# Altium schematic sheet obc-v2_TMP-eMMC.SchDoc
size 420 x 297 mm; SheetNumber: 6; SheetTotal: 23
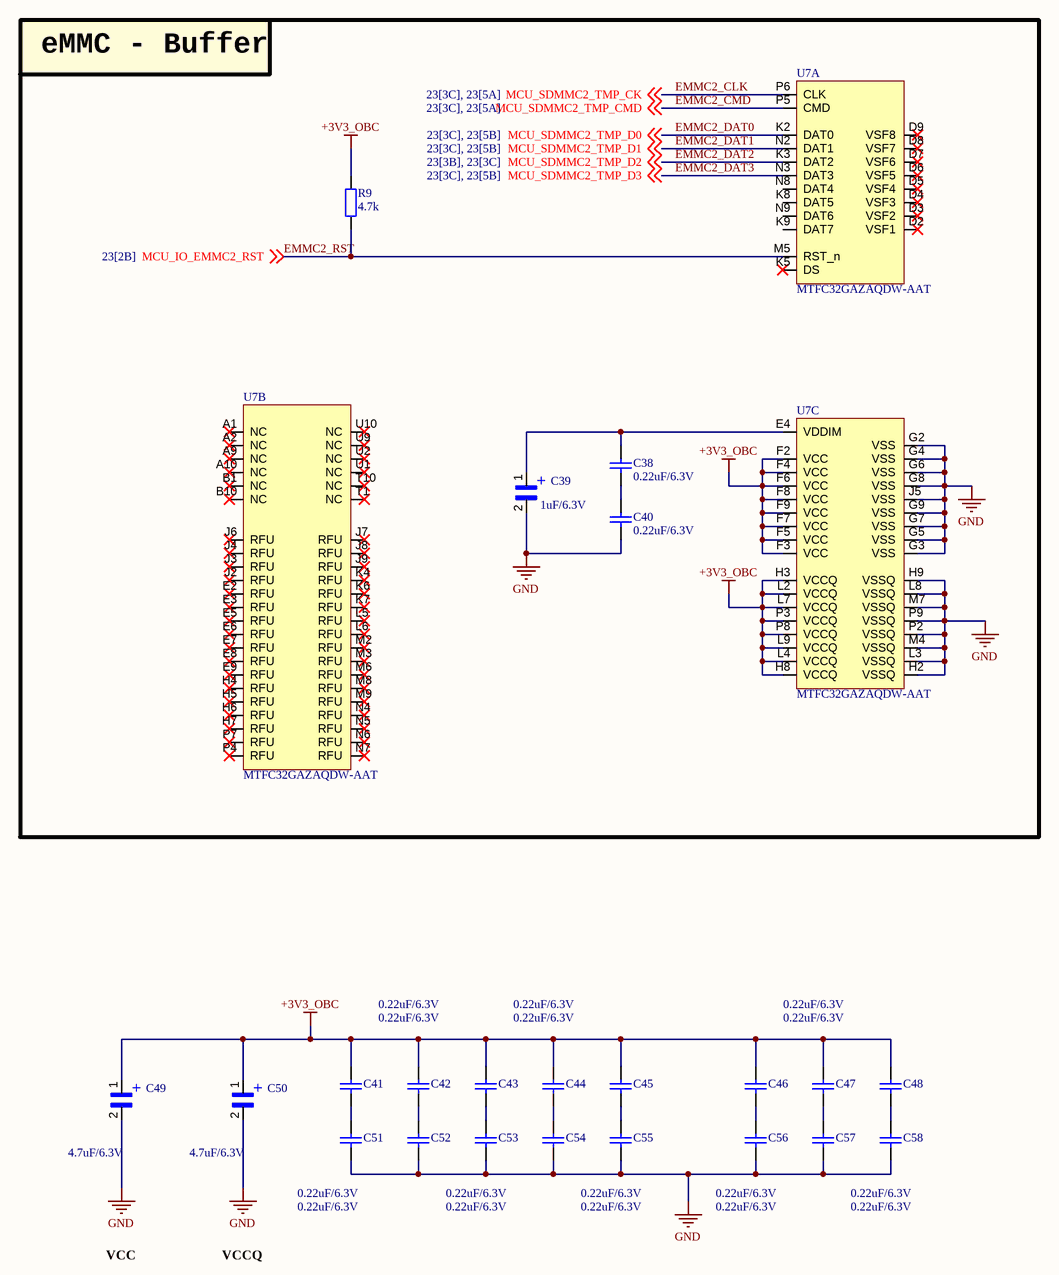
[diagram p0: obc-v2_TMP-eMMC.SchDoc]

## Parts
C38  0.22uF/6.3V  [CAP_C_1005X60]
C39  1uF/6.3V  [CAP_MP_1608X90]
C40  0.22uF/6.3V  [CAP_C_1005X60]
C41  0.22uF/6.3V  [CAP_C_1005X60]
C42  0.22uF/6.3V  [CAP_C_1005X60]
C43  0.22uF/6.3V  [CAP_C_1005X60]
C44  0.22uF/6.3V  [CAP_C_1005X60]
C45  0.22uF/6.3V  [CAP_C_1005X60]
C46  0.22uF/6.3V  [CAP_C_1005X60]
C47  0.22uF/6.3V  [CAP_C_1005X60]
C48  0.22uF/6.3V  [CAP_C_1005X60]
C49  4.7uF/6.3V  [CAP_MP_1608X90]
C50  4.7uF/6.3V  [CAP_MP_1608X90]
C51  0.22uF/6.3V  [CAP_C_1005X60]
C52  0.22uF/6.3V  [CAP_C_1005X60]
C53  0.22uF/6.3V  [CAP_C_1005X60]
C54  0.22uF/6.3V  [CAP_C_1005X60]
C55  0.22uF/6.3V  [CAP_C_1005X60]
C56  0.22uF/6.3V  [CAP_C_1005X60]
C57  0.22uF/6.3V  [CAP_C_1005X60]
C58  0.22uF/6.3V  [CAP_C_1005X60]
R9  4.7k  [RES_C_1608X60]
U7  MTFC32GAZAQDW-AAT  [BGA_100_C_100P_10X17_1400X1800X150]  (parts A,B,C of 3)

## Blocks framed on the sheet
eMMC - Buffer: C38-C40 R9 U7

## Nets
+3V3_OBC: C41.1 C42.1 C43.1 C44.1 C45.1 C46.1 C47.1 C48.1 C49.1 C50.1 R9.1 U7.F2(VCC) U7.F3(VCC) U7.F4(VCC) U7.F5(VCC) U7.F6(VCC) U7.F7(VCC) U7.F8(VCC) U7.F9(VCC) U7.H3(VCCQ) U7.H8(VCCQ) U7.L2(VCCQ) U7.L4(VCCQ) U7.L7(VCCQ) U7.L9(VCCQ) U7.P3(VCCQ) U7.P8(VCCQ)
GND: C39.2 C40.2 C49.2 C50.2 C51.2 C52.2 C53.2 C54.2 C55.2 C56.2 C57.2 C58.2 U7.G2(VSS) U7.G3(VSS) U7.G4(VSS) U7.G5(VSS) U7.G6(VSS) U7.G7(VSS) U7.G8(VSS) U7.G9(VSS) U7.H2(VSSQ) U7.H9(VSSQ) U7.J5(VSS) U7.L3(VSSQ) U7.L8(VSSQ) U7.M4(VSSQ) U7.M7(VSSQ) U7.P2(VSSQ) U7.P9(VSSQ)
EMMC2_CLK: U7.P6(CLK) ; off-sheet MCU_SDMMC2_TMP_CK  [also labelled MCU_SDMMC2_TMP_CK]
EMMC2_CMD: U7.P5(CMD) ; off-sheet MCU_SDMMC2_TMP_CMD  [also labelled MCU_SDMMC2_TMP_CMD]
EMMC2_DAT0: U7.K2(DAT0) ; off-sheet MCU_SDMMC2_TMP_D0  [also labelled MCU_SDMMC2_TMP_D0]
EMMC2_DAT1: U7.N2(DAT1) ; off-sheet MCU_SDMMC2_TMP_D1  [also labelled MCU_SDMMC2_TMP_D1]
EMMC2_DAT2: U7.K3(DAT2) ; off-sheet MCU_SDMMC2_TMP_D2  [also labelled MCU_SDMMC2_TMP_D2]
EMMC2_DAT3: U7.N3(DAT3) ; off-sheet MCU_SDMMC2_TMP_D3  [also labelled MCU_SDMMC2_TMP_D3]
EMMC2_RST: R9.2 U7.M5(RST_n) ; off-sheet MCU_IO_EMMC2_RST  [also labelled MCU_IO_EMMC2_RST]
NetC38_1: C38.1 C39.1 U7.E4(VDDIM)
NetC38_2: C38.2 C40.1
NetC41_2: C41.2 C51.1
NetC42_2: C42.2 C52.1
NetC43_2: C43.2 C53.1
NetC44_2: C44.2 C54.1
NetC45_2: C45.2 C55.1
NetC46_2: C46.2 C56.1
NetC47_2: C47.2 C57.1
NetC48_2: C48.2 C58.1

Not connected (* = marked no-connect by the designer): U7 A1(NC)* A2(NC)* A9(NC)* A10(NC)* B1(NC)* B10(NC)* D2(VSF1)* D3(VSF2)* D4(VSF3)* D5(VSF4)* D6(VSF5)* D7(VSF6)* D8(VSF7)* D9(VSF8)* E2(RFU)* E3(RFU)* E5(RFU)* E6(RFU)* E7(RFU)* E8(RFU)* E9(RFU)* H4(RFU)* H5(RFU)* H6(RFU)* H7(RFU)* J2(RFU)* J3(RFU)* J4(RFU)* J6(RFU)* J7(RFU)* J8(RFU)* J9(RFU)* K4(RFU)* K5(DS)* K6(RFU)* K7(RFU)* K8(DAT5) K9(DAT7) L5(RFU)* L6(RFU)* M2(RFU)* M3(RFU)* M6(RFU)* M8(RFU)* M9(RFU)* N4(RFU)* N5(RFU)* N6(RFU)* N7(RFU)* N8(DAT4) N9(DAT6) P4(RFU)* P7(RFU)* T1(NC)* T10(NC)* U1(NC)* U2(NC)* U9(NC)* U10(NC)*

## Notes on the sheet
- VCC
- VCCQ
- Project:
- Sub-system:
- Design by:
- Sheet title:
- Sheet
- A3
- of
- Checked by:
- Approved by:
- Revision:
- Document No:
- Size:
- Date:
- (in symbol TACL335M003RTA) +

## Library data of the parts
C38 C40-C48 C51-C58 = Tu 0402 33nF 10V: CAPC; Chung_Loai: Dán; Don_Vi: Con; So_Chan: 2; Ten_Linh_Kien: Tụ 0402 33nF X7R 10V GRM155R71A333KA01D; Ma_Hang: MH007853; Kieu_Chan: *
C39 C49 C50 = TACL335M003RTA: CAPP; Package: None; Price: None; Value: *; MP: TACL335M003RTA; Availability: Unavailable
R9 = Tro 0603 1% 10k: RES; Chung_Loai: Dán; Don_Vi: Con; So_Chan: 2; Ten_Linh_Kien: Trở 0603 1% 10k; Ma_Hang: MH006333; Kieu_Chan: *